# Altium schematic sheet LQFP (32-100 PIN) 0.5mm.SchDoc
size A4; SheetNumber: 1; SheetTotal: 1
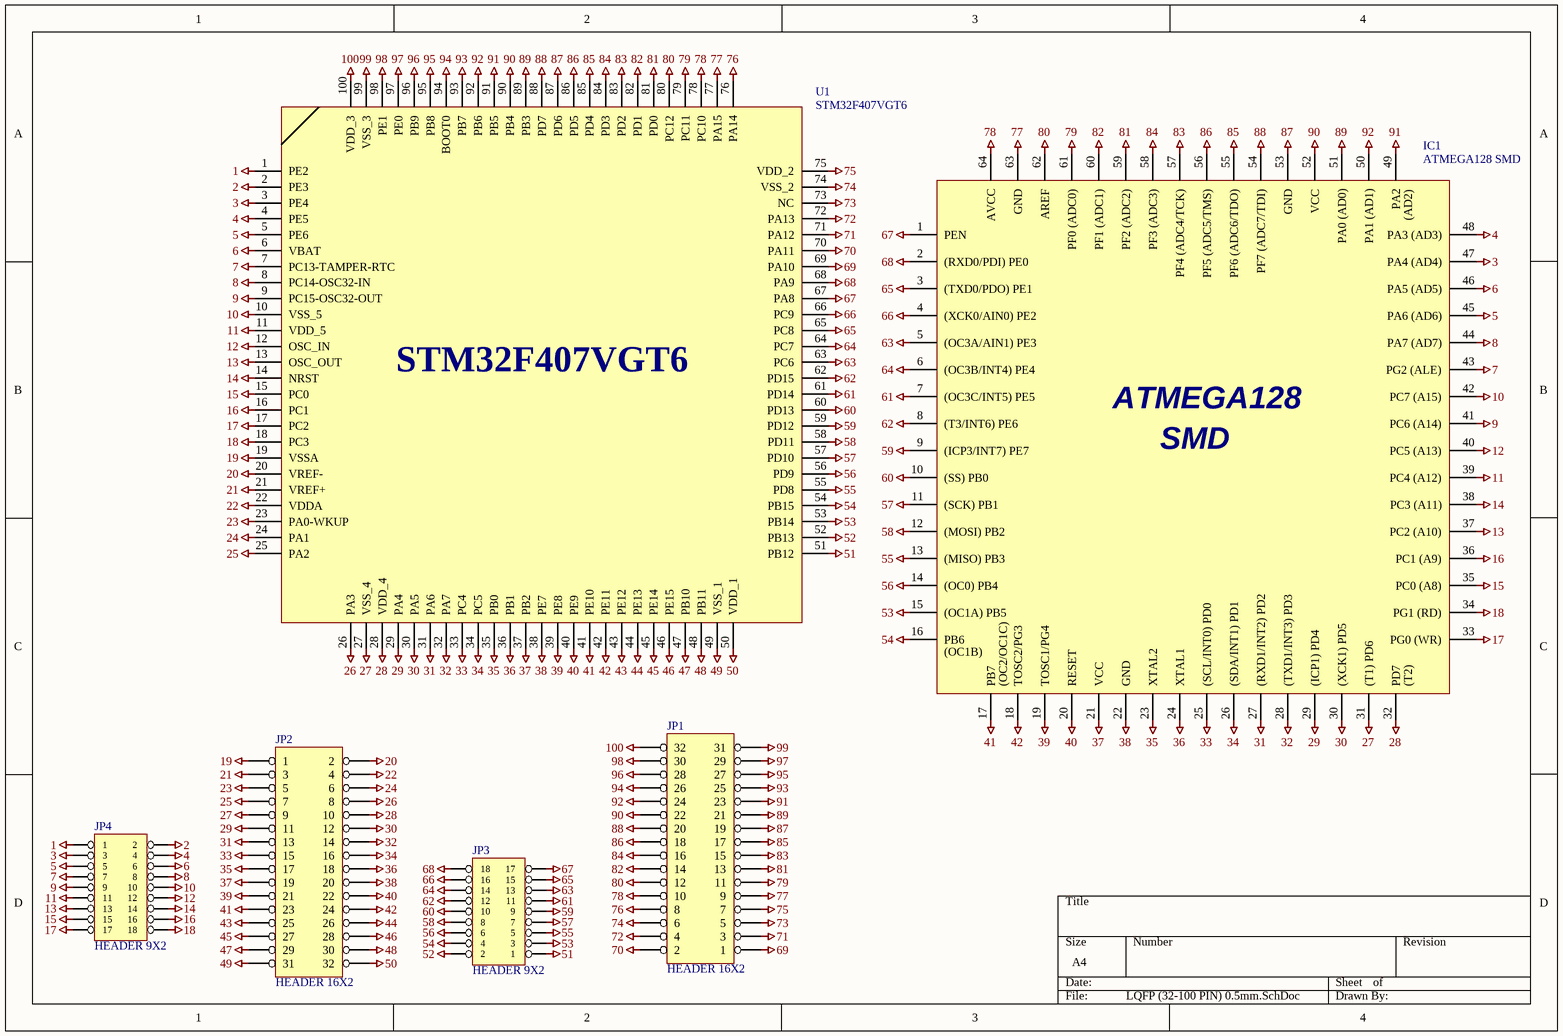
[diagram p0: LQFP (32-100 PIN) 0.5mm.SchDoc]

## Parts
IC1  ATMEGA128 SMD  [TQFP 32-64 0.8mm]
JP1  HEADER 16X2  [Double Row 32P 2.54mm]
JP2  HEADER 16X2  [Double Row 32P 2.54mm]
JP3  HEADER 9X2  [Double Row 18P 2.54mm]
JP4  HEADER 9X2  [Double Row 18P 2.54mm]
U1  STM32F407VGT6  [LQFP (32-100 PIN) 0.5mm]

## Nets
1: JP4.1 U1.1(PE2)
2: JP4.2 U1.2(PE3)
3: IC1.47(PA4_(AD4)) JP4.3 U1.3(PE4)
4: IC1.48(PA3_(AD3)) JP4.4 U1.4(PE5)
5: IC1.45(PA6_(AD6)) JP4.5 U1.5(PE6)
6: IC1.46(PA5_(AD5)) JP4.6 U1.6(VBAT)
7: IC1.43(PG2_(ALE)) JP4.7 U1.7(PC13-TAMPER-RTC)
8: IC1.44(PA7_(AD7)) JP4.8 U1.8(PC14-OSC32-IN)
9: IC1.41(PC6_(A14)) JP4.9 U1.9(PC15-OSC32-OUT)
10: IC1.42(PC7_(A15)) JP4.10 U1.10(VSS_5)
11: IC1.39(PC4_(A12)) JP4.11 U1.11(VDD_5)
12: IC1.40(PC5_(A13)) JP4.12 U1.12(OSC_IN)
13: IC1.37(PC2_(A10)) JP4.13 U1.13(OSC_OUT)
14: IC1.38(PC3_(A11)) JP4.14 U1.14(NRST)
15: IC1.35(PC0_(A8)) JP4.15 U1.15(PC0)
16: IC1.36(PC1_(A9)) JP4.16 U1.16(PC1)
17: IC1.33(PG0_(WR)) JP4.17 U1.17(PC2)
18: IC1.34(PG1_(RD)) JP4.18 U1.18(PC3)
19: JP2.1 U1.19(VSSA)
20: JP2.2 U1.20(VREF-)
21: JP2.3 U1.21(VREF+)
22: JP2.4 U1.22(VDDA)
23: JP2.5 U1.23(PA0-WKUP)
24: JP2.6 U1.24(PA1)
25: JP2.7 U1.25(PA2)
26: JP2.8 U1.26(PA3)
27: IC1.31((T1)_PD6) JP2.9 U1.27(VSS_4)
28: IC1.32(PD7) JP2.10 U1.28(VDD_4)
29: IC1.29((ICP1)_PD4) JP2.11 U1.29(PA4)
30: IC1.30((XCK1)_PD5) JP2.12 U1.30(PA5)
31: IC1.27((RXD1/INT2)_PD2) JP2.13 U1.31(PA6)
32: IC1.28((TXD1/INT3)_PD3) JP2.14 U1.32(PA7)
33: IC1.25((SCL/INT0)_PD0) JP2.15 U1.33(PC4)
34: IC1.26((SDA/INT1)_PD1) JP2.16 U1.34(PC5)
35: IC1.23(XTAL2) JP2.17 U1.35(PB0)
36: IC1.24(XTAL1) JP2.18 U1.36(PB1)
37: IC1.21(VCC) JP2.19 U1.37(PB2)
38: IC1.22(GND) JP2.20 U1.38(PE7)
39: IC1.19(TOSC1/PG4) JP2.21 U1.39(PE8)
40: IC1.20(RESET) JP2.22 U1.40(PE9)
41: IC1.17(PB7) JP2.23 U1.41(PE10)
42: IC1.18(TOSC2/PG3) JP2.24 U1.42(PE11)
43: JP2.25 U1.43(PE12)
44: JP2.26 U1.44(PE13)
45: JP2.27 U1.45(PE14)
46: JP2.28 U1.46(PE15)
47: JP2.29 U1.47(PB10)
48: JP2.30 U1.48(PB11)
49: JP2.31 U1.49(VSS_1)
50: JP2.32 U1.50(VDD_1)
51: JP3.1 U1.51(PB12)
52: JP3.2 U1.52(PB13)
53: IC1.15((OC1A)_PB5) JP3.3 U1.53(PB14)
54: IC1.16(PB6) JP3.4 U1.54(PB15)
55: IC1.13((MISO)_PB3) JP3.5 U1.55(PD8)
56: IC1.14((OC0)_PB4) JP3.6 U1.56(PD9)
57: IC1.11((SCK)_PB1) JP3.7 U1.57(PD10)
58: IC1.12((MOSI)_PB2) JP3.8 U1.58(PD11)
59: IC1.9((ICP3/INT7)_PE7) JP3.9 U1.59(PD12)
60: IC1.10((SS)_PB0) JP3.10 U1.60(PD13)
61: IC1.7((OC3C/INT5)_PE5) JP3.11 U1.61(PD14)
62: IC1.8((T3/INT6)_PE6) JP3.12 U1.62(PD15)
63: IC1.5((OC3A/AIN1)_PE3) JP3.13 U1.63(PC6)
64: IC1.6((OC3B/INT4)_PE4) JP3.14 U1.64(PC7)
65: IC1.3((TXD0/PDO)_PE1) JP3.15 U1.65(PC8)
66: IC1.4((XCK0/AIN0)_PE2) JP3.16 U1.66(PC9)
67: IC1.1(PEN) JP3.17 U1.67(PA8)
68: IC1.2((RXD0/PDI)_PE0) JP3.18 U1.68(PA9)
69: JP1.1 U1.69(PA10)
70: JP1.2 U1.70(PA11)
71: JP1.3 U1.71(PA12)
72: JP1.4 U1.72(PA13)
73: JP1.5 U1.73(NC)
74: JP1.6 U1.74(VSS_2)
75: JP1.7 U1.75(VDD_2)
76: JP1.8 U1.76(PA14)
77: IC1.63(GND) JP1.9 U1.77(PA15)
78: IC1.64(AVCC) JP1.10 U1.78(PC10)
79: IC1.61(PF0_(ADC0)) JP1.11 U1.79(PC11)
80: IC1.62(AREF) JP1.12 U1.80(PC12)
81: IC1.59(PF2_(ADC2)) JP1.13 U1.81(PD0)
82: IC1.60(PF1_(ADC1)) JP1.14 U1.82(PD1)
83: IC1.57(PF4_(ADC4/TCK)) JP1.15 U1.83(PD2)
84: IC1.58(PF3_(ADC3)) JP1.16 U1.84(PD3)
85: IC1.55(PF6_(ADC6/TDO)) JP1.17 U1.85(PD4)
86: IC1.56(PF5_(ADC5/TMS)) JP1.18 U1.86(PD5)
87: IC1.53(GND) JP1.19 U1.87(PD6)
88: IC1.54(PF7_(ADC7/TDI)) JP1.20 U1.88(PD7)
89: IC1.51(PA0_(AD0)) JP1.21 U1.89(PB3)
90: IC1.52(VCC) JP1.22 U1.90(PB4)
91: IC1.49(PA2) JP1.23 U1.91(PB5)
92: IC1.50(PA1_(AD1)) JP1.24 U1.92(PB6)
93: JP1.25 U1.93(PB7)
94: JP1.26 U1.94(BOOT0)
95: JP1.27 U1.95(PB8)
96: JP1.28 U1.96(PB9)
97: JP1.29 U1.97(PE0)
98: JP1.30 U1.98(PE1)
99: JP1.31 U1.99(VSS_3)
100: JP1.32 U1.100(VDD_3)

## Notes on the sheet
- (in symbol ATMEGA128 SMD) (AD2); ATMEGA128; SMD; (OC1B); (OC2/OC1C); (T2)